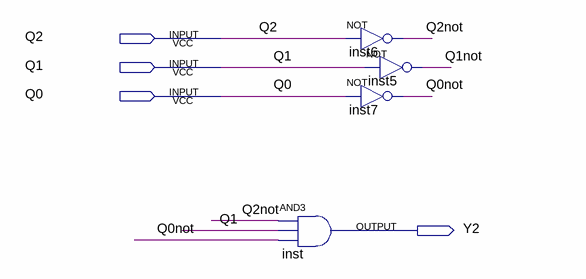
[diagram p0: schematic sheet]
// Quartus schematic Y2.bdf as structural Verilog: 4 symbols, 4 pins
module Y2 (
  input  Q2,
  input  Q1,
  input  Q0,
  output Y2
);

  wire Q0not, Q1not, Q2not;

  and inst (Y2, Q2not, Q1, Q0not);
  not inst6 (Q2not, Q2);
  not inst5 (Q1not, Q1);
  not inst7 (Q0not, Q0);
endmodule
